# Altium schematic sheet Driver_Relay_SPDT.SchDoc
size 76 x 55 mm
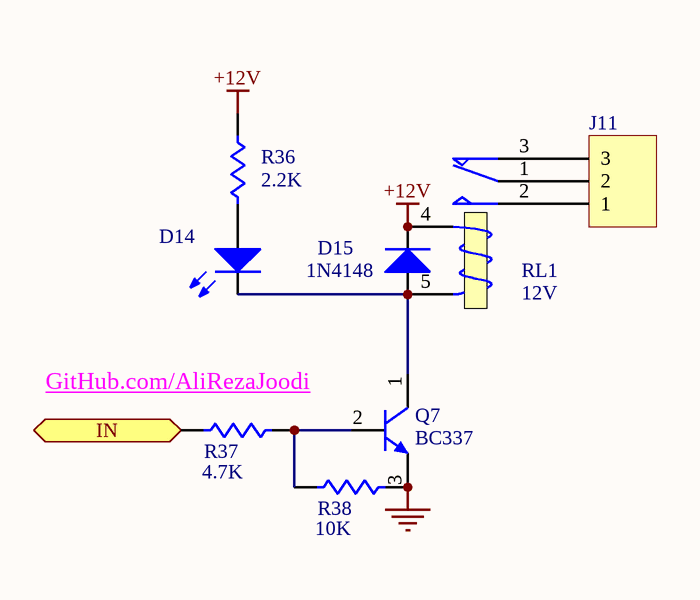
[diagram p0: Driver_Relay_SPDT.SchDoc]

## Parts
D14  LED  [LED-5mm_Red]  (value not drawn)
D15  value 1N4148  [DIODE-0.4]  (hidden comment: Diode)
J11  Header 3  [Fonics_3PIN_1]  (value not drawn)
Q7  value BC337  [TO92C]  (hidden comment: NPN)
R36  value 2.2K  [AXIAL-0.4]  (hidden comment: Resistor)
R37  value 4.7K  [AXIAL-0.4]  (hidden comment: Resistor)
R38  value 10K  [AXIAL-0.4]  (hidden comment: Resistor)
RL1  value 12V  [RELAY-SPDT-1]  (hidden comment: RL1)

## Ports
IN (in)

## Nets
+12V: D15.2(K) R36.1 RL1.4(T1)
GND: Q7.3(E) R38.1
IN: R37.2 ; port IN
NetD14_1: D14.1(A) R36.2
NetD14_2: D14.2(K) D15.1(A) Q7.1(C) RL1.5(T2)
NetJ11_1: J11.1 RL1.2(NO)
NetJ11_2: J11.2 RL1.1(COM)
NetJ11_3: J11.3 RL1.3(NC)
NetQ7_2: Q7.2(B) R37.1 R38.2

## Notes on the sheet
- (near R37) GitHub.com/AliRezaJoodi

## Library data of the parts
D14 = LED: Typical INFRARED GaAs LED; Manufacturer: Generic Components; Class I: Optoelectronic; Published: 8-Jun-2000; Revision: July-2002: Re-released for DXP Platform.; Publisher: Altium Limited; Class II: LED
D15 = Diode: Default Diode; Manufacturer: Generic Components; Class I: Discrete; Class II: Diode - Switching; Published: 8-Jun-2000; Revision: July-2002: Re-released for DXP Platform.; Publisher: Altium Limited
J11 = Header 3: Header, 3-Pin; LatestRevisionDate: 17-Jul-2002; LatestRevisionNote: Re-released for DXP Platform.; Publisher: Altium Limited
Q7 = NPN: NPN Bipolar Transistor; Manufacturer: Generic Components; Class I: Discrete; Class II: BJT - Low Power; Published: 8-Jun-2000; Revision: July-2002: Re-released for DXP Platform.; Publisher: Altium Limited
R36-R38 = Res1: Manufacturer: Generic Components; Class I: Passive; Published: 8-Jun-2000; Revision: July-2002: Re-released for DXP Platform.; Publisher: Altium Limited; Class II: Resistor
RL1 = Relay-SPDT_2: SPDT Relay; Manufacturer: Generic Components; Class I: Electro-mechanical; Published: 8-Jun-2000; Revision: July-2002: Re-released for DXP Platform.; Publisher: Altium Limited; Class II: Relay